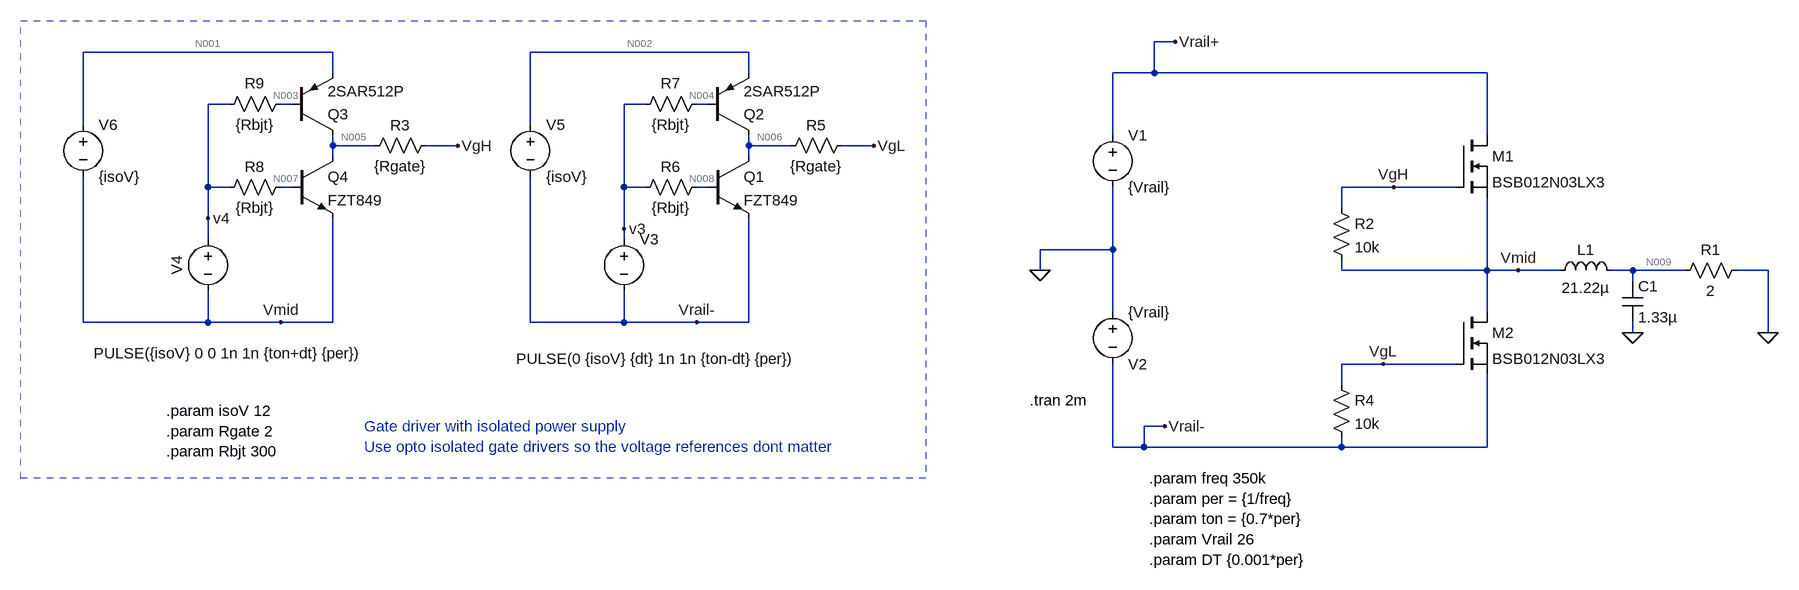
[diagram p0: schematic halfbridge.asc]
halfbridge.asc, the LTspice schematic file:
Version 4.1
SHEET 1 880 680
WIRE -160 -160 -192 -160
WIRE -1456 -144 -1840 -144
WIRE -816 -144 -1152 -144
WIRE -1456 -112 -1456 -144
WIRE -816 -112 -816 -144
WIRE -192 -112 -192 -160
WIRE -192 -112 -256 -112
WIRE 320 -112 -192 -112
WIRE -1616 -64 -1648 -64
WIRE -1520 -64 -1536 -64
WIRE -976 -64 -1008 -64
WIRE -880 -64 -896 -64
WIRE -1840 -32 -1840 -144
WIRE -1152 -32 -1152 -144
WIRE -256 -16 -256 -112
WIRE 320 -16 320 -112
WIRE -1456 0 -1456 -16
WIRE -1392 0 -1456 0
WIRE -1264 0 -1312 0
WIRE -816 0 -816 -16
WIRE -752 0 -816 0
WIRE -624 0 -672 0
WIRE -1456 16 -1456 0
WIRE -816 16 -816 0
WIRE -1648 64 -1648 -64
WIRE -1616 64 -1648 64
WIRE -1520 64 -1536 64
WIRE -1008 64 -1008 -64
WIRE -976 64 -1008 64
WIRE -880 64 -896 64
WIRE 176 64 96 64
WIRE 272 64 176 64
WIRE 96 96 96 64
WIRE -1648 112 -1648 64
WIRE -1008 128 -1008 64
WIRE -1648 144 -1648 112
WIRE -1008 144 -1008 128
WIRE -256 160 -256 64
WIRE -256 160 -368 160
WIRE -368 192 -368 160
WIRE 96 192 96 176
WIRE 320 192 320 80
WIRE 320 192 96 192
WIRE 368 192 320 192
WIRE 432 192 368 192
WIRE 544 192 512 192
WIRE 624 192 544 192
WIRE 752 192 704 192
WIRE 544 208 544 192
WIRE -256 256 -256 160
WIRE 320 256 320 192
WIRE -1840 272 -1840 48
WIRE -1648 272 -1648 224
WIRE -1648 272 -1840 272
WIRE -1536 272 -1648 272
WIRE -1456 272 -1456 112
WIRE -1456 272 -1536 272
WIRE -1152 272 -1152 48
WIRE -1008 272 -1008 224
WIRE -1008 272 -1152 272
WIRE -896 272 -1008 272
WIRE -816 272 -816 112
WIRE -816 272 -896 272
WIRE 544 288 544 272
WIRE 752 288 752 192
WIRE 160 336 96 336
WIRE 272 336 160 336
WIRE 96 368 96 336
WIRE -176 432 -208 432
WIRE -256 464 -256 336
WIRE -208 464 -208 432
WIRE -208 464 -256 464
WIRE 96 464 96 448
WIRE 96 464 -208 464
WIRE 320 464 320 352
WIRE 320 464 96 464
FLAG -368 192 0
FLAG 544 288 0
FLAG 752 288 0
FLAG -176 432 Vrail-
FLAG -160 -160 Vrail+
FLAG 368 192 Vmid
FLAG 176 64 VgH
FLAG 160 336 VgL
FLAG -1264 0 VgH
FLAG -624 0 VgL
FLAG -896 272 Vrail-
FLAG -1536 272 Vmid
FLAG -1648 112 v4
FLAG -1008 128 v3
SYMBOL nmos 272 -16 R0
SYMATTR InstName M1
SYMATTR Value BSB012N03LX3
SYMBOL nmos 272 256 R0
SYMATTR InstName M2
SYMATTR Value BSB012N03LX3
SYMBOL voltage -256 -32 R0
WINDOW 123 0 0 Left 0
WINDOW 39 0 0 Left 0
SYMATTR InstName V1
SYMATTR Value {Vrail}
SYMBOL voltage -256 240 R0
WINDOW 0 24 96 Left 2
WINDOW 3 24 16 Left 2
WINDOW 123 0 0 Left 0
WINDOW 39 0 0 Left 0
SYMATTR InstName V2
SYMATTR Value {Vrail}
SYMBOL ind 416 208 R270
WINDOW 0 32 56 VTop 2
WINDOW 3 5 56 VBottom 2
SYMATTR InstName L1
SYMATTR Value 21.22µ
SYMBOL cap 528 208 R0
SYMATTR InstName C1
SYMATTR Value 1.33µ
SYMBOL res 720 176 R90
WINDOW 0 0 56 VBottom 2
WINDOW 3 32 56 VTop 2
SYMATTR InstName R1
SYMATTR Value 2
SYMBOL voltage -1008 128 R0
WINDOW 3 -166 200 Left 2
WINDOW 123 0 0 Left 0
WINDOW 39 0 0 Left 0
SYMATTR InstName V3
SYMATTR Value PULSE(0 {isoV} {dt} 1n 1n {ton-dt} {per})
SYMBOL voltage -1648 128 R0
WINDOW 0 -32 56 VBottom 2
WINDOW 3 32 207 Bottom 2
WINDOW 123 0 0 Left 0
WINDOW 39 0 0 Left 0
SYMATTR InstName V4
SYMATTR Value PULSE({isoV} 0 0 1n 1n {ton+dt} {per})
SYMBOL res 80 80 R0
SYMATTR InstName R2
SYMATTR Value 10k
SYMBOL res 80 352 R0
SYMATTR InstName R4
SYMATTR Value 10k
SYMBOL res -1296 -16 R90
WINDOW 0 0 56 VBottom 2
WINDOW 3 32 56 VTop 2
SYMATTR InstName R3
SYMATTR Value {Rgate}
SYMBOL res -656 -16 R90
WINDOW 0 0 56 VBottom 2
WINDOW 3 32 56 VTop 2
SYMATTR InstName R5
SYMATTR Value {Rgate}
SYMBOL voltage -1152 -48 R0
WINDOW 123 0 0 Left 0
WINDOW 39 0 0 Left 0
SYMATTR InstName V5
SYMATTR Value {isoV}
SYMBOL voltage -1840 -48 R0
WINDOW 123 0 0 Left 0
WINDOW 39 0 0 Left 0
SYMATTR InstName V6
SYMATTR Value {isoV}
SYMBOL npn -880 16 R0
SYMATTR InstName Q1
SYMATTR Value FZT849
SYMBOL pnp -880 -16 M180
SYMATTR InstName Q2
SYMATTR Value 2SAR512P
SYMBOL res -880 48 R90
WINDOW 0 0 56 VBottom 2
WINDOW 3 32 56 VTop 2
SYMATTR InstName R6
SYMATTR Value {Rbjt}
SYMBOL res -880 -80 R90
WINDOW 0 0 56 VBottom 2
WINDOW 3 32 56 VTop 2
SYMATTR InstName R7
SYMATTR Value {Rbjt}
SYMBOL pnp -1520 -16 M180
SYMATTR InstName Q3
SYMATTR Value 2SAR512P
SYMBOL npn -1520 16 R0
SYMATTR InstName Q4
SYMATTR Value FZT849
SYMBOL res -1520 48 R90
WINDOW 0 0 56 VBottom 2
WINDOW 3 32 56 VTop 2
SYMATTR InstName R8
SYMATTR Value {Rbjt}
SYMBOL res -1520 -80 R90
WINDOW 0 0 56 VBottom 2
WINDOW 3 32 56 VTop 2
SYMATTR InstName R9
SYMATTR Value {Rbjt}
TEXT -384 392 Left 2 !.tran 2m
TEXT -200 512 Left 2 !.param freq 350k\n.param per = {1/freq}\n.param ton = {0.7*per}\n.param Vrail 26\n.param DT {0.001*per}
TEXT -1712 408 Left 2 !.param isoV 12\n.param Rgate 2\n.param Rbjt 300
TEXT -1408 432 Left 2 ;Gate driver with isolated power supply\nUse opto isolated gate drivers so the voltage references dont matter
RECTANGLE Normal -544 512 -1936 -192 2

The netlist it stands for:
* halfbridge.asc
M1 Vrail+ VgH Vmid Vmid BSB012N03LX3
M2 Vmid VgL Vrail- Vrail- BSB012N03LX3
V1 Vrail+ 0 {Vrail}
V2 0 Vrail- {Vrail}
L1 Vmid N009 21.22µ
C1 N009 0 1.33µ
R1 0 N009 2
V3 v3 Vrail- PULSE(0 {isoV} {dt} 1n 1n {ton-dt} {per})
V4 v4 Vmid PULSE({isoV} 0 0 1n 1n {ton+dt} {per})
R2 VgH Vmid 10k
R4 VgL Vrail- 10k
R3 VgH N005 {Rgate}
R5 VgL N006 {Rgate}
V5 N002 Vrail- {isoV}
V6 N001 Vmid {isoV}
Q1 N006 N008 Vrail- 0 FZT849
Q2 N006 N004 N002 0 2SAR512P
R6 N008 v3 {Rbjt}
R7 N004 v3 {Rbjt}
Q3 N005 N003 N001 0 2SAR512P
Q4 N005 N007 Vmid 0 FZT849
R8 N007 v4 {Rbjt}
R9 N003 v4 {Rbjt}
.model NPN NPN
.model PNP PNP
.lib standard.bjt
.model NMOS NMOS
.model PMOS PMOS
.lib standard.mos
.tran 2m
.param freq 350k
.param per = {1/freq}
.param ton = {0.7*per}
.param Vrail 26
.param DT {0.001*per}
.param isoV 12
.param Rgate 2
.param Rbjt 300
* Gate driver with isolated power supply
* Use opto isolated gate drivers so the voltage references dont matter
.backanno
.end

* Results of the author's LTspice run, read from the files saved beside the schematic
* Operating Point, zero values left out:
*   V(vgh) = -25.99 V
*   V(vgl) = -14.01 V
*   V(vrail-) = -26 V
*   V(v3) = -26 V
*   V(n006) = -14.01 V
*   V(n001) = -13.99 V
*   V(n008) = -26 V
*   V(n003) = -13.99 V
*   V(vrail+) = 26 V
*   V(vmid) = -25.99 V
*   V(n009) = -25.98 V
*   V(v4) = -13.99 V
*   V(n005) = -25.99 V
*   V(n002) = -14 V
*   V(n004) = -14.84 V
*   V(n007) = -25.23 V
*   Id(M1) = 129.9 pA
*   Is(M1) = -129.9 pA
*   I(V1) = -174.6 pA
*   I(R4) = 1.199 mA
*   I(R5) = -1.199 mA
*   I(V5) = -38.39 mA
*   Ic(Q1) = 13.15 pA
*   Ib(Q1) = -12.67 pA
*   I(R7) = 37.19 mA
*   I(L1) = -12.99 A
*   I(V3) = 37.19 mA
*   Ic(Q4) = -190 nA
*   Ib(Q4) = 37.47 mA
*   Ie(Q4) = -37.47 mA
*   I(R2) = 190 nA
*   I(R3) = -190 nA
*   Ic(Q2) = -1.199 mA
*   Ib(Q2) = -37.19 mA
*   Ie(Q2) = 38.39 mA
*   I(R6) = 12.53 pA
*   I(R8) = -37.47 mA
*   I(R9) = -12.25 pA
*   Id(M2) = 12.99 A
*   Is(M2) = -12.99 A
*   I(V2) = -12.99 A
*   I(R1) = 12.99 A
*   I(V4) = -37.47 mA
*   Ic(Q3) = -12.6 pA
*   Ib(Q3) = 12.25 pA